# EAGLE design M993 (EAGLE 6.6.0)
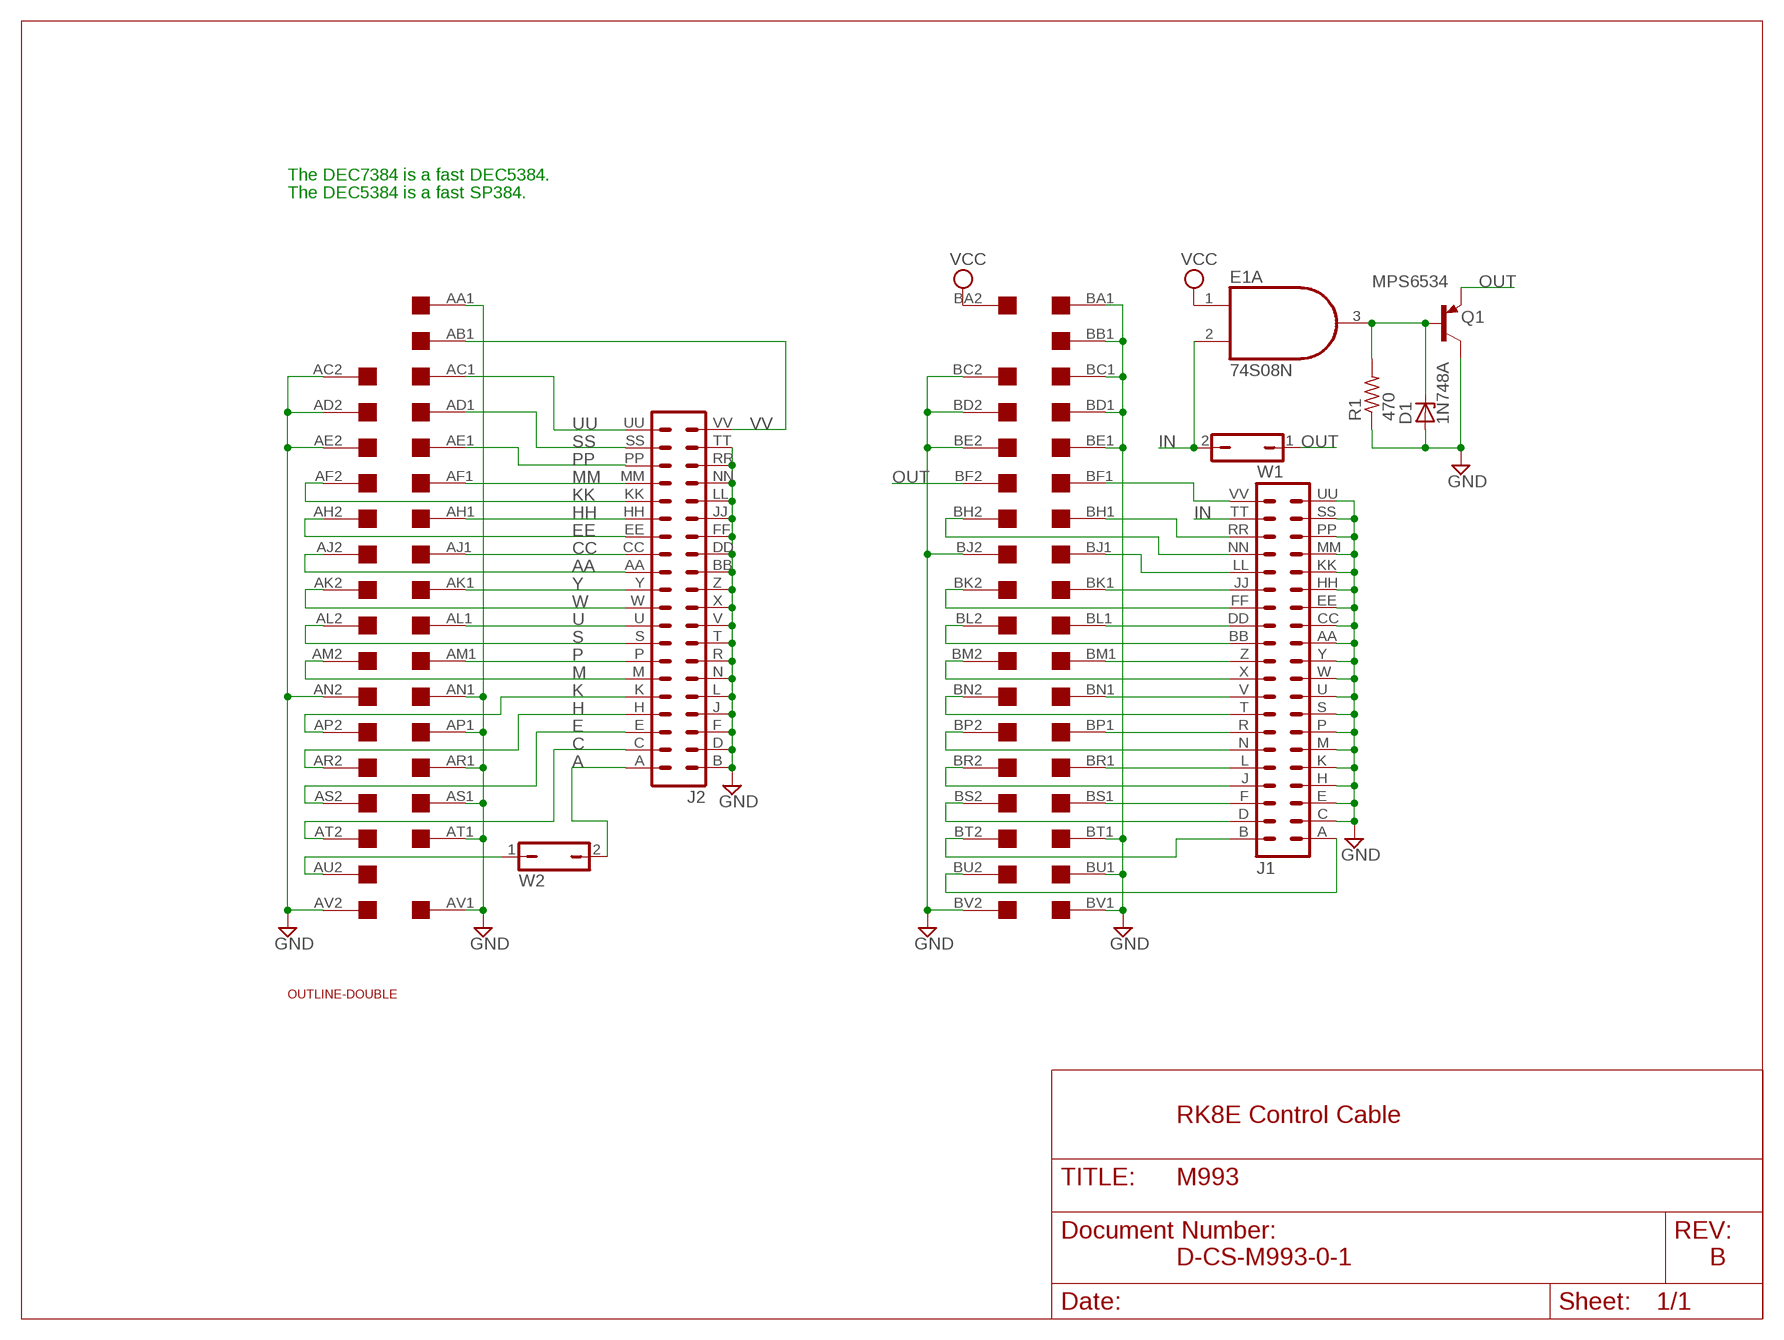
[diagram p0: schematic, sheet 1]

## Parts
D1  1N748A  ZENER-DIODEZD-10  [ZDIO-10]
E1  74S08N  [DIL14]
J1  DEC40PINH  [DEC40PINH]
J2  DEC40PINH  [DEC40PINH]
Q1  MPS6534  -PNP-TO92  [TO92]
R1  470  R-US_0207/10  [0207/10]
U$1  OUTLINE-DOUBLE  [DOUBLE]
U$2  DOUBLE  [EDGE-CON4]
W1  JP1Q  [JP1]
W2  JP1Q  [JP1]

## Nets
A: J2.A W2.2
AA: J2.AA U$2.AJ2
C: J2.C U$2.AT2
CC: J2.CC U$2.AJ1
E: J2.E U$2.AS2
EE: J2.EE U$2.AH2
GND: D1.A J1.AA J1.C J1.CC J1.E J1.EE J1.H J1.HH J1.K J1.KK J1.M J1.MM J1.P J1.PP J1.S J1.SS J1.U J1.UU J1.W J1.Y J2.B J2.BB J2.D J2.DD J2.F J2.FF J2.J J2.JJ J2.L J2.LL J2.N J2.NN J2.R J2.RR J2.T J2.TT J2.V J2.X J2.Z Q1.3(C) R1.1 U$2.AA1 U$2.AC2 U$2.AD2 U$2.AE2 U$2.AN1 U$2.AN2 U$2.AP1 U$2.AR1 U$2.AS1 U$2.AT1 U$2.AV1 U$2.AV2 U$2.BA1 U$2.BB1 U$2.BC1 U$2.BC2 U$2.BD1 U$2.BD2 U$2.BE1 U$2.BE2 U$2.BJ2 U$2.BT1 U$2.BU1 U$2.BV1 U$2.BV2
H: J2.H U$2.AR2
HH: J2.HH U$2.AH1
IN: E1.2(A:I1) J1.TT W1.2
K: J2.K U$2.AP2
KK: J2.KK U$2.AF2
M: J2.M U$2.AM2
MM: J2.MM U$2.AF1
N$1: U$2.AU2 W2.1
N$2: D1.C E1.3(A:O) Q1.2(B) R1.2
N$3: J1.D U$2.BS2
N$4: J1.F U$2.BS1
N$5: J1.J U$2.BR2
N$6: J1.L U$2.BR1
N$7: J1.N U$2.BP2
N$8: J1.R U$2.BP1
N$9: J1.T U$2.BN2
N$10: J1.A U$2.BU2
N$11: J1.B U$2.BT2
N$12: J1.V U$2.BN1
N$13: J1.X U$2.BM2
N$14: J1.Z U$2.BM1
N$15: J1.BB U$2.BL2
N$16: J1.DD U$2.BL1
N$17: J1.FF U$2.BK2
N$18: J1.JJ U$2.BK1
N$19: J1.LL U$2.BJ1
N$20: J1.NN U$2.BH2
N$21: J1.RR U$2.BH1
N$23: J1.VV U$2.BF1
OUT: Q1.1(E) U$2.BF2 W1.1
P: J2.P U$2.AM1
PP: J2.PP U$2.AE1
S: J2.S U$2.AL2
SS: J2.SS U$2.AD1
U: J2.U U$2.AL1
UU: J2.UU U$2.AC1
VCC: E1.1(A:I0) U$2.BA2
VV: J2.VV U$2.AB1
W: J2.W U$2.AK2
Y: J2.Y U$2.AK1
Unconnected: E1.4(B:I0) E1.5(B:I1) E1.6(B:O) E1.8(C:O) E1.9(C:I0) E1.10(C:I1) E1.11(D:O) E1.12(D:I0) E1.13(D:I1) U$2.AA2 U$2.AB2 U$2.AU1 U$2.BB2

## Notes on the sheet
- The DEC7384 is a fast DEC5384.
- The DEC5384 is a fast SP384.
- RK8E Control Cable
- D-CS-M993-0-1 | B

## Power pins joined to a net without a drawn wire
GND: E1.7(P:GND)
VCC: E1.14(P:VCC)

## Library data of the parts
D1 = diode:ZENER-DIODE: Z-Diode
E1 = 74xx-us:74*08: Quad 2-input AND gate
J1 J2 = dec-con:DEC40PIN: PIN HEADER
Q1 = transistor:*-PNP-: PNP Transistror
R1 = rcl:R-US_: RESISTOR, American symbol
U$1 = dec-con:OUTLINE-*: Board outlines for DEC boards.
U$2 = dec-con:DOUBLE: Double-Height DEC board
W1 W2 = jumper:JP1Q: JUMPER

## Board
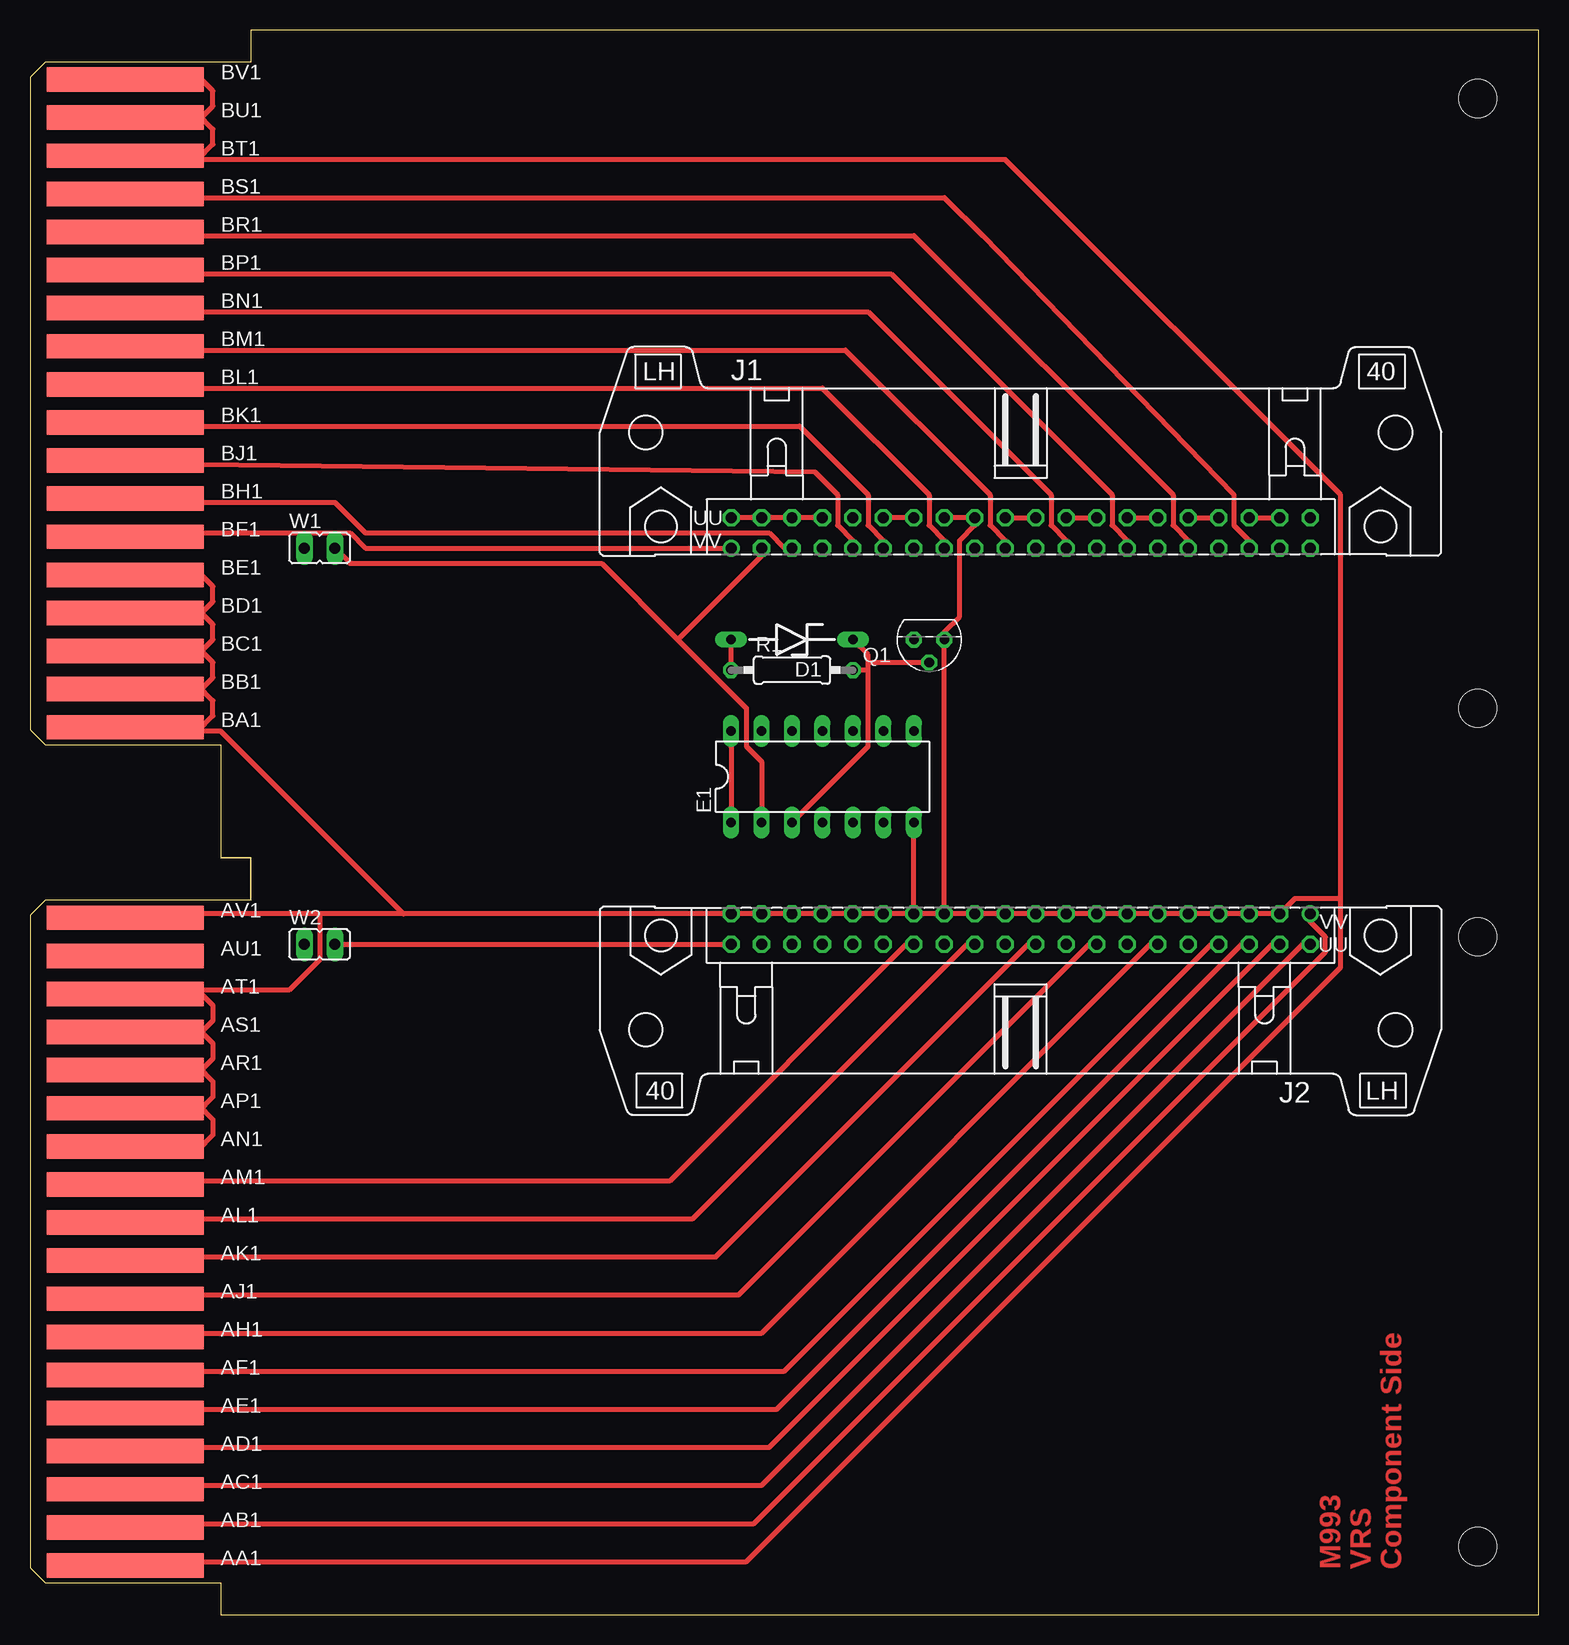
[diagram p1: board, top side]
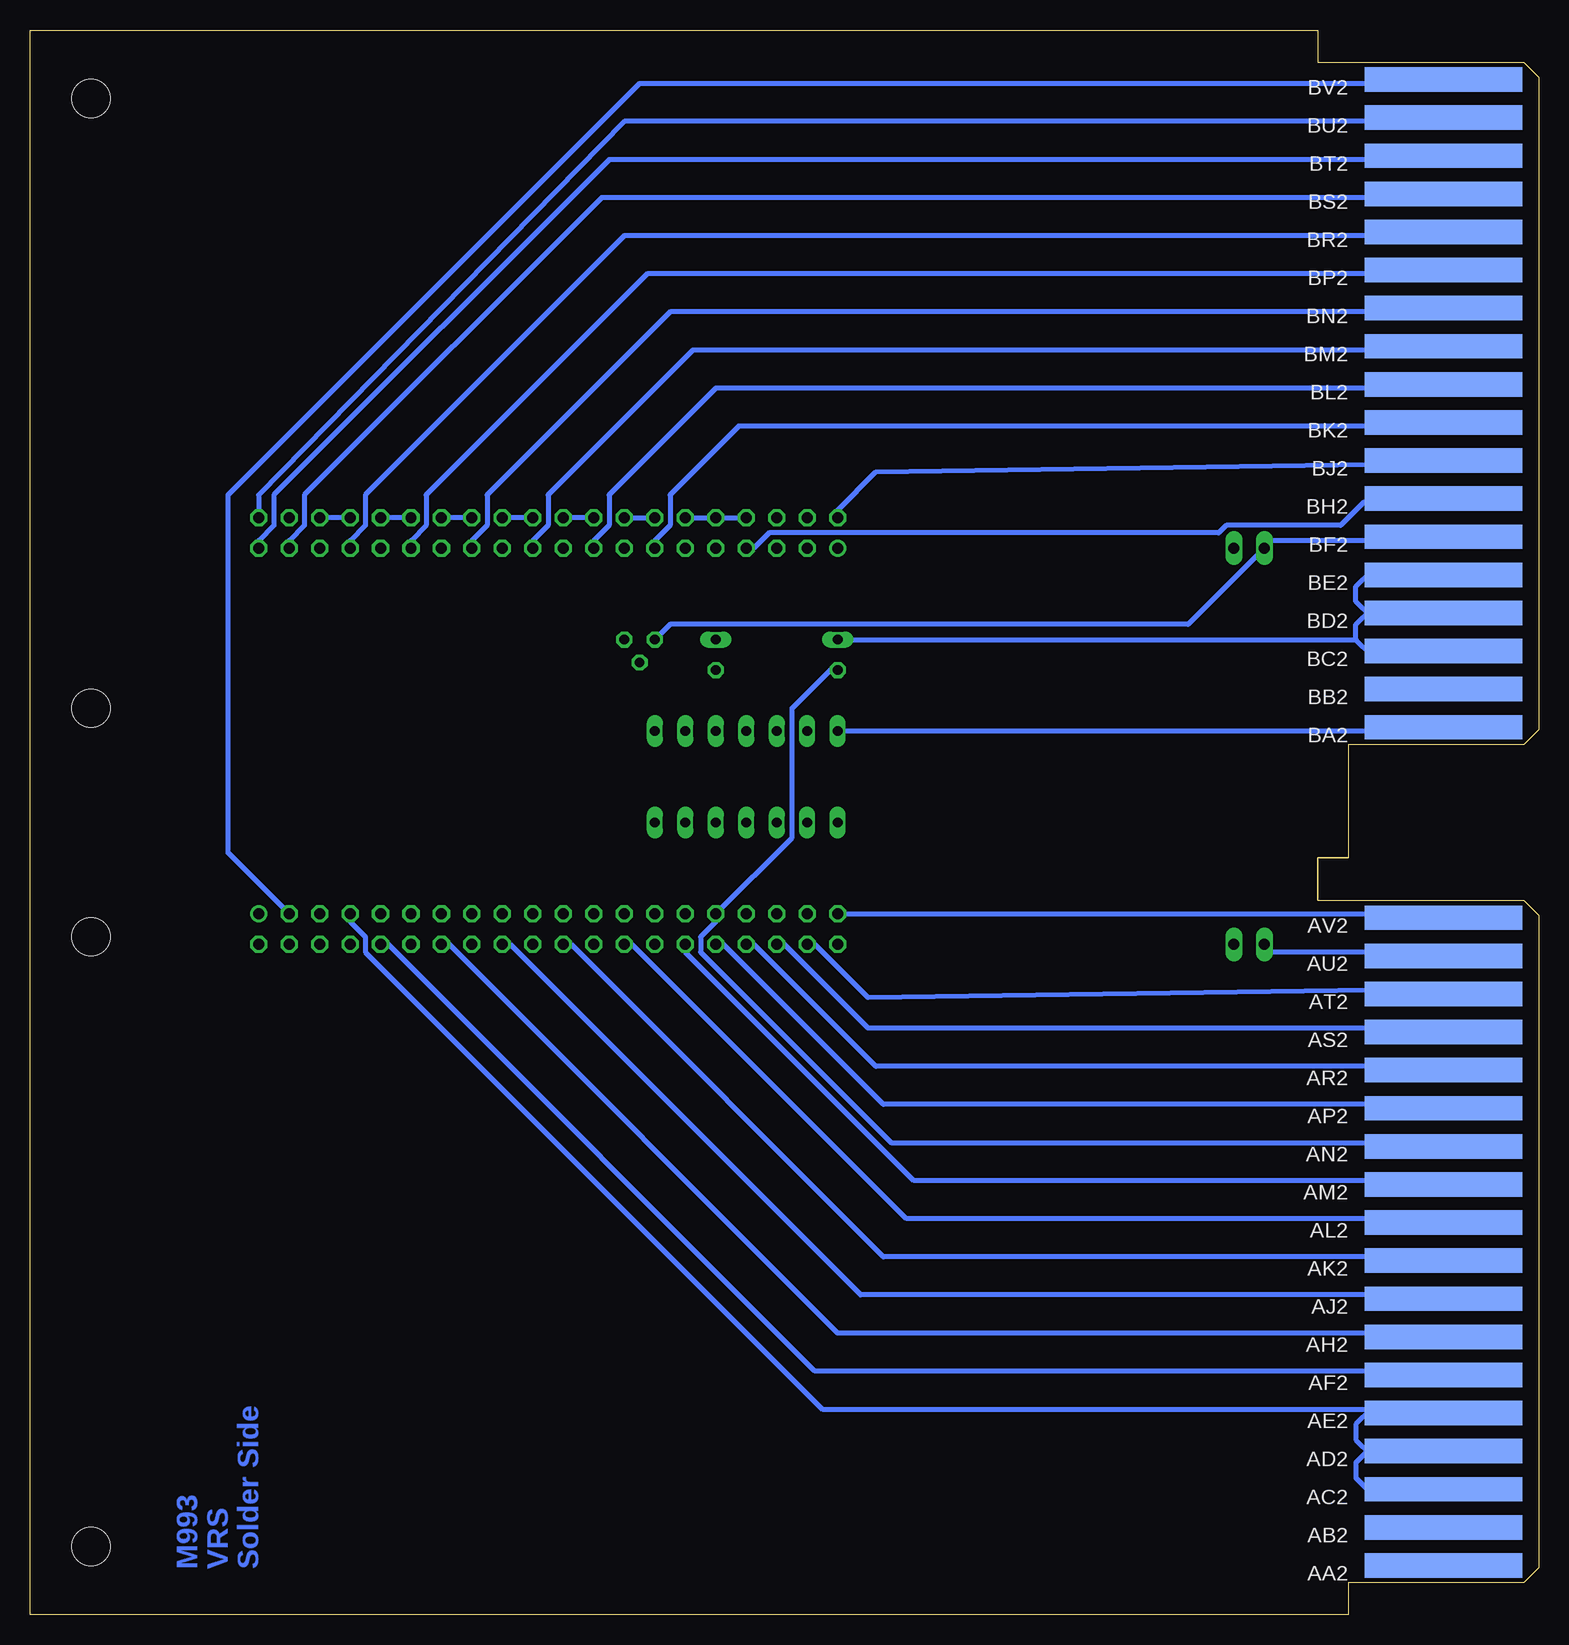
[diagram p2: board, bottom side, seen from below]

Size 125.73 x 132.08 mm. Coordinates in mm from the lower left corner, seen from the top.
Copper layers (1+16): Top 0.035mm / dielectric 1.5mm / Bottom 0.035mm
Design rules "16mils": minimum track width 16mil, minimum drill 32mil, track to track 15mil, track to pad 10mil, pad to pad 10mil, via to via 10mil, smd to smd 10mil, copper to edge 13mil, drill to drill 10mil, minimum pad ring 10mil, minimum via ring 8mil, stop-mask expansion 0mil, vias tented up to drill 0mil, thermal gap 10mil

### Footprints (pad centres in the part's own frame; a part is rotated, then mirrored left to right if it is on the bottom)
ZDIO-10 = drill 0.813 long: A 5.08,0; C -5.08,0
DIL14 = drill 0.813 long: 1 -7.62,-3.81; 2 -5.08,-3.81; 3 -2.54,-3.81; 4 0,-3.81; 5 2.54,-3.81; 6 5.08,-3.81; 7 7.62,-3.81; 8 7.62,3.81; 9 5.08,3.81; 10 2.54,3.81; 11 0,3.81; 12 -2.54,3.81; 13 -5.08,3.81; 14 -7.62,3.81
DEC40PINH = drill 0.914 octagon: A 24.13,1.27; AA -3.81,1.27; B 24.13,-1.27; BB -3.81,-1.27; C 21.59,1.27; CC -6.35,1.27; D 21.59,-1.27; DD -6.35,-1.27; E 19.05,1.27; EE -8.89,1.27; F 19.05,-1.27; FF -8.89,-1.27; H 16.51,1.27; HH -11.43,1.27; J 16.51,-1.27; JJ -11.43,-1.27; K 13.97,1.27; KK -13.97,1.27; L 13.97,-1.27; LL -13.97,-1.27; M 11.43,1.27; MM -16.51,1.27; N 11.43,-1.27; NN -16.51,-1.27; P 8.89,1.27; PP -19.05,1.27; R 8.89,-1.27; RR -19.05,-1.27; S 6.35,1.27; SS -21.59,1.27; T 6.35,-1.27; TT -21.59,-1.27; U 3.81,1.27; UU -24.13,1.27; V 3.81,-1.27; W 1.27,1.27; X 1.27,-1.27; Y -1.27,1.27; Z -1.27,-1.27 | drill 0.914: VV -24.13,-1.27
TO92 = drill 0.813 octagon: 1 1.27,0; 2 0,1.905; 3 -1.27,0
0207/10 = drill 0.813 octagon: 1 -5.08,0; 2 5.08,0
DOUBLE = hole 3.175: 120.65,56.515; 120.65,5.715; 120.65,75.565; 120.65,126.365
EDGE-CON4 = smd 13.106 x 2.032: AA1 7.938,4.128; AB1 7.938,7.303; AC1 7.938,10.477; AD1 7.938,13.652; AE1 7.938,16.828; AF1 7.938,20.003; AH1 7.938,23.177; AJ1 7.938,26.352; AK1 7.938,29.527; AL1 7.938,32.703; AM1 7.938,35.877; AN1 7.938,39.053; AP1 7.938,42.227; AR1 7.938,45.403; AS1 7.938,48.578; AT1 7.938,51.752; AU1 7.938,54.928; AV1 7.938,58.102; BA1 7.938,73.978; BB1 7.938,77.153; BC1 7.938,80.328; BD1 7.938,83.502; BE1 7.938,86.677; BF1 7.938,89.853; BH1 7.938,93.028; BJ1 7.938,96.203; BK1 7.938,99.377; BL1 7.938,102.552; BM1 7.938,105.728; BN1 7.938,108.903; BP1 7.938,112.078; BR1 7.938,115.252; BS1 7.938,118.427; BT1 7.938,121.603; BU1 7.938,124.778; BV1 7.938,127.953 | smd 13.106 x 2.032 bottom: AA2 7.938,4.128; AB2 7.938,7.303; AC2 7.938,10.477; AD2 7.938,13.652; AE2 7.938,16.828; AF2 7.938,20.003; AH2 7.938,23.177; AJ2 7.938,26.352; AK2 7.938,29.527; AL2 7.938,32.703; AM2 7.938,35.877; AN2 7.938,39.053; AP2 7.938,42.227; AR2 7.938,45.403; AS2 7.938,48.578; AT2 7.938,51.752; AU2 7.938,54.928; AV2 7.938,58.102; BA2 7.938,73.978; BB2 7.938,77.153; BC2 7.938,80.328; BD2 7.938,83.502; BE2 7.938,86.677; BF2 7.938,89.853; BH2 7.938,93.028; BJ2 7.938,96.203; BK2 7.938,99.377; BL2 7.938,102.552; BM2 7.938,105.728; BN2 7.938,108.903; BP2 7.938,112.078; BR2 7.938,115.252; BS2 7.938,118.427; BT2 7.938,121.603; BU2 7.938,124.778; BV2 7.938,127.953
JP1 = drill 0.914 long: 1 0,-1.27; 2 0,1.27

### Placement (x,y rotation side)
D1  63.5,81.28 180 top
E1  66.04,69.85 0 top
J1  82.55,90.17 0 top
J2  82.55,57.15 180 top
Q1  74.93,81.28 180 top
R1  63.5,78.74 0 top
U$1  0,0 0 top
U$2  0,0 0 top
W1  24.13,88.9 270 top
W2  24.13,55.88 270 top

### Tracks (layer width: path | path; a pad name or v marks a point on that pad's centre or on a via)
A
  Top 0.406: W2.2 26.04,55.88 57.79,55.88 J2.A
AA
  Bottom 0.406: J2.AA 85.73,55.88 56.52,26.67 13.97,26.67 U$2.AJ2
C
  Bottom 0.406: J2.C 60.33,55.88 55.88,51.44 13.97,52.07 U$2.AT2
CC
  Top 0.406: J2.CC 88.27,55.88 59.06,26.67 13.97,26.67 U$2.AJ1
E
  Bottom 0.406: J2.E 62.87,55.88 55.88,48.9 13.97,48.9 U$2.AS2
EE
  Bottom 0.406: J2.EE 90.81,55.88 58.42,23.5 13.97,23.5 U$2.AH2
GND
  Top 0.406: U$2.BV1 13.97,128.27 15.24,127 15.24,125.73 13.97,124.46 U$2.BU1 13.97,125.09 15.24,123.83 15.24,122.56 13.97,121.28 | R1.1 D1.A | 13.97,52.07 15.24,50.8 15.24,49.53 13.97,48.26 U$2.AS1 13.97,48.9 15.24,47.62 15.24,46.35 13.97,45.09 U$2.AR1 13.97,45.72 15.24,44.45 15.24,43.18 13.97,41.91 U$2.AP1 13.97,42.55 15.24,41.27 15.24,40.01 13.97,38.73 U$2.AN2 | 13.97,73.66 15.24,74.93 15.24,76.2 13.97,77.47 U$2.BB1 13.97,76.83 15.24,78.11 15.24,79.38 13.97,80.64 U$2.BC1 13.97,80.01 15.24,81.28 15.24,82.55 13.97,83.82 U$2.BD1 13.97,83.19 15.24,84.45 15.24,85.72 13.97,87 U$2.BE1 | J2.R E1.7 | J2.T J2.R | J2.T J2.V J2.X J2.Z J2.BB J2.DD J2.FF J2.JJ J2.LL J2.NN J2.RR J2.TT 105.41,59.69 109.22,59.69 | J2.R J2.N J2.L J2.J J2.F J2.D J2.B 31.12,58.42 | 31.12,58.42 24.13,58.42 | 24.13,58.42 13.97,58.42 U$2.AV2 | U$2.AA1 13.97,4.45 59.69,4.45 109.22,53.98 109.22,59.69 | 13.97,73.66 15.88,73.66 31.12,58.42 | 13.97,73.66 U$2.BA1 | 13.97,52.07 21.59,52.07 24.13,54.61 24.13,58.42 | 13.97,52.07 U$2.AT1 | J2.T Q1.3 76.2,81.92 77.47,83.19 77.47,89.53 78.74,90.81 J1.AA J1.CC | J1.UU J1.SS J1.PP J1.MM | J1.EE J1.HH | J1.Y J1.W | J1.U J1.S | J1.P J1.M | J1.K J1.H | J1.E J1.C | 13.97,121.28 81.28,121.28 109.22,93.34 109.22,59.69 | 13.97,121.28 U$2.BT1
  Bottom 0.406: 15.24,81.28 15.24,82.55 13.97,83.82 U$2.BD1 13.97,83.19 15.24,84.45 15.24,85.72 13.97,87 U$2.BE1 | U$2.BJ2 13.97,95.89 55.25,95.25 58.42,92.08 J1.UU | 15.24,81.28 13.97,80.01 U$2.BC1 | D1.A 15.24,81.28 | U$2.AC2 13.97,10.16 15.24,11.43 15.24,12.7 13.97,13.97 U$2.AD2 13.97,13.34 15.24,14.61 15.24,15.88 13.97,17.14 | U$2.AV2 13.97,58.42 J2.B | U$2.AN2 13.97,39.37 53.98,39.37 69.85,55.24 69.85,56.52 68.58,57.78 J2.L 62.23,64.77 62.23,75.56 59.06,78.74 R1.1 | J2.TT 109.22,63.5 109.22,93.34 74.93,127.64 13.97,127.64 U$2.BV1 | 13.97,17.14 59.69,17.14 97.79,55.24 97.79,56.52 99.06,57.78 J2.NN | 13.97,17.14 U$2.AE2 | J1.MM J1.KK J1.HH | J1.CC J1.EE | J1.AA J1.Y | J1.W J1.U | J1.S J1.P | J1.M J1.K | J1.H J1.E
H
  Bottom 0.406: J2.H 65.41,55.88 55.25,45.72 13.97,45.72 U$2.AR2
HH
  Top 0.406: J2.HH 93.35,55.88 60.96,23.5 13.97,23.5 U$2.AH1
IN
  Top 0.406: 53.98,81.28 47.63,87.63 26.67,87.63 W1.2 | 53.98,81.28 59.69,75.56 59.69,72.39 60.96,71.12 E1.2 | 53.98,81.28 60.96,88.27 J1.TT
K
  Bottom 0.406: J2.K 67.95,55.88 54.61,42.55 13.97,42.55 U$2.AP2
KK
  Bottom 0.406: J2.KK 95.89,55.88 60.33,20.32 13.97,20.32 U$2.AF2
M
  Bottom 0.406: J2.M 71.12,55.24 52.07,36.2 13.97,36.2 U$2.AM2
MM
  Top 0.406: J2.MM 98.43,55.88 62.87,20.32 13.97,20.32 U$2.AF1
N$1
  Bottom 0.406: W2.1 22.23,55.24 8.26,55.24 U$2.AU2
N$2
  Top 0.406: 69.85,79.38 69.85,80.01 D1.C | 69.85,78.74 69.85,79.38 | 69.85,78.74 69.85,72.39 E1.3 | 69.85,78.74 R1.2 | 69.85,79.38 Q1.2
N$3
  Bottom 0.406: U$2.BS2 13.34,118.11 78.11,118.11 102.87,93.34 102.87,90.81 104.14,89.53 J1.D
N$4
  Top 0.406: U$2.BS1 13.34,118.11 76.2,118.11 79.38,114.94 100.33,93.34 100.33,90.81 101.6,89.53 J1.F
N$5
  Bottom 0.406: U$2.BR2 13.97,114.94 76.2,114.94 97.79,93.34 97.79,90.81 99.06,89.53 J1.J
N$6
  Top 0.406: U$2.BR1 13.97,114.94 73.66,114.94 95.25,93.34 95.25,90.81 96.52,89.53 J1.L
N$7
  Bottom 0.406: U$2.BP2 13.97,111.76 74.3,111.76 92.71,93.34 92.71,90.81 93.98,89.53 J1.N
N$8
  Top 0.406: U$2.BP1 13.97,111.76 71.76,111.76 90.17,93.34 90.17,90.81 91.44,89.53 J1.R
N$9
  Bottom 0.406: U$2.BN2 13.97,108.58 72.39,108.58 87.63,93.34 87.63,90.81 88.9,89.53 J1.T
N$10
  Bottom 0.406: U$2.BU2 13.97,124.46 76.2,124.46 106.68,93.34 J1.A
N$11
  Bottom 0.406: U$2.BT2 13.97,121.28 77.47,121.28 105.41,93.34 105.41,90.81 106.68,89.53 J1.B
N$12
  Top 0.406: U$2.BN1 13.97,108.58 69.85,108.58 85.09,93.34 85.09,90.81 86.36,89.53 J1.V
N$13
  Bottom 0.406: U$2.BM2 13.97,105.41 70.49,105.41 82.55,93.34 82.55,90.81 83.82,89.53 J1.X
N$14
  Top 0.406: U$2.BM1 13.97,105.41 67.95,105.41 80.01,93.34 80.01,90.81 81.28,89.53 J1.Z
N$15
  Bottom 0.406: U$2.BL2 13.97,102.23 68.58,102.23 77.47,93.34 77.47,90.81 78.74,89.53 J1.BB
N$16
  Top 0.406: U$2.BL1 13.97,102.23 66.04,102.23 74.93,93.34 74.93,90.81 76.2,89.53 J1.DD
N$17
  Bottom 0.406: U$2.BK2 13.97,99.06 66.68,99.06 72.39,93.34 72.39,90.81 73.66,89.53 J1.FF
N$18
  Top 0.406: U$2.BK1 13.97,99.06 64.14,99.06 69.85,93.34 69.85,90.81 71.12,89.53 J1.JJ
N$19
  Top 0.406: U$2.BJ1 13.97,95.89 65.41,95.25 67.31,93.34 67.31,90.81 68.58,89.53 J1.LL
N$20
  Bottom 0.406: U$2.BH2 14.61,92.71 16.51,90.81 26.04,90.81 26.67,90.17 64.14,90.17 65.41,88.9 J1.NN
N$21
  Top 0.406: 13.97,92.71 U$2.BH1 13.34,92.71 25.4,92.71 27.94,90.17 61.6,90.17 62.87,88.9 J1.RR
N$23
  Top 0.406: U$2.BF1 14.61,90.17 26.67,90.17 27.94,88.9 J1.VV
OUT
  Bottom 0.406: U$2.BF2 13.97,89.53 22.23,89.53 W1.1 29.21,82.55 72.39,82.55 Q1.1
P
  Top 0.406: J2.P 73.03,55.88 53.34,36.2 13.97,36.2 U$2.AM1
PP
  Top 0.406: J2.PP 100.97,55.88 62.23,17.14 13.97,17.14 U$2.AE1
S
  Bottom 0.406: J2.S 75.57,55.88 52.71,33.02 13.97,33.02 U$2.AL2
SS
  Top 0.406: J2.SS 103.51,55.88 61.6,13.97 13.97,13.97 U$2.AD1
U
  Top 0.406: J2.U 78.11,55.88 55.25,33.02 13.97,33.02 U$2.AL1
UU
  Top 0.406: J2.UU 106.05,55.88 60.96,10.79 13.97,10.79 U$2.AC1
VCC
  Top 0.406: E1.14 58.42,72.39 58.42,67.31 E1.1
  Bottom 0.406: E1.14 57.79,73.66 13.97,73.66 U$2.BA2
VV
  Top 0.406: J2.VV 106.68,57.78 107.95,56.52 107.95,55.24 60.33,7.62 13.97,7.62 U$2.AB1
W
  Bottom 0.406: J2.W 80.65,55.88 54.61,29.84 13.97,29.84 U$2.AK2
Y
  Top 0.406: J2.Y 83.19,55.88 57.15,29.84 13.97,29.84 U$2.AK1

### Text on the board
Top: M993 | VRS | Component Side
Bottom: Solder Side | VRS | M993
tValues: A | VV | A | VV